# Altium schematic sheet F4 DFC.SchDoc: F4 Drone Flight Controller
size A4; Author: Miłosz Werner & Julia Rzepka; DrawnBy: Miłosz Werner; Organization: Wroclaw University of Science and Technology; DocumentNumber: 1; Revision: 1.0; SheetNumber: 1; SheetTotal: 9
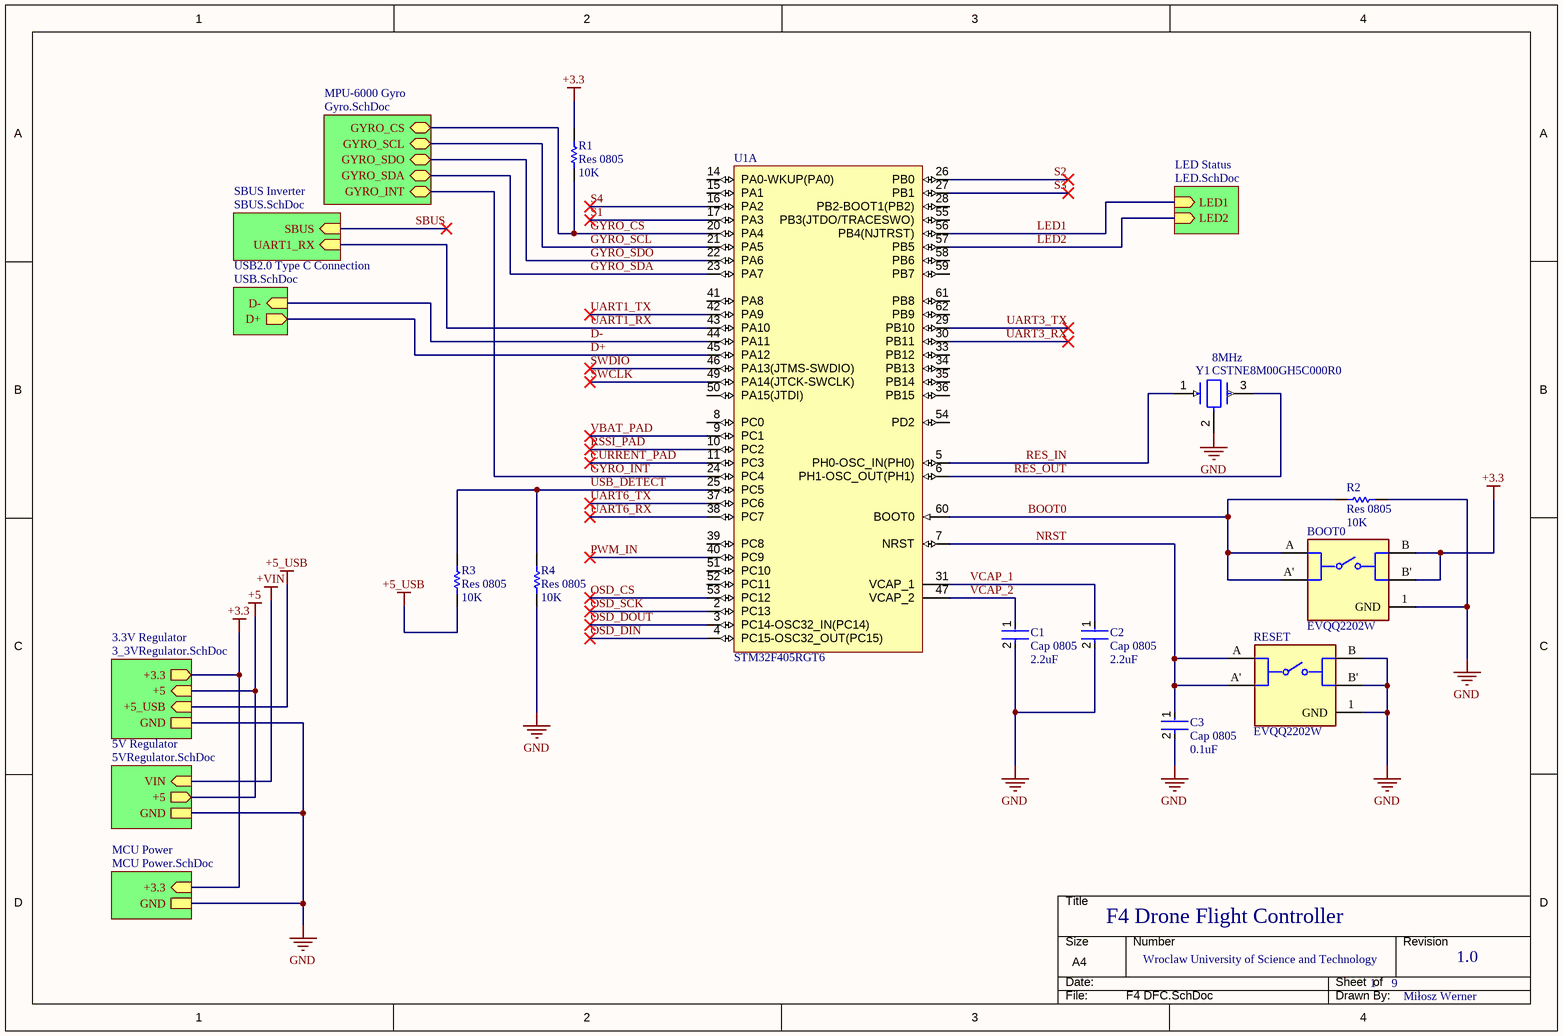
[diagram p0: F4 DFC.SchDoc]

## Parts
BOOT0  EVQQ2202W  [FP-EVQQ2202W-MFG]
C1  Cap 0805  value 2.2uF  [FP-GRM216-0_1-IPC_C]
C2  Cap 0805  value 2.2uF  [FP-GRM216-0_1-IPC_C]
C3  Cap 0805  value 0.1uF  [FP-GRM216-0_1-IPC_C]
R1  Res 0805  value 10K  [RESC2013X50X30LL20T20]
R2  Res 0805  value 10K  [RESC2013X50X30LL20T20]
R3  Res 0805  value 10K  [RESC2013X50X30LL20T20]
R4  Res 0805  value 10K  [RESC2013X50X30LL20T20]
RESET  EVQQ2202W  [FP-EVQQ2202W-MFG]
U1  STM32F405RGT6  [STM-LQFP64_V]  (part A of 2)
Y1  CSTNE8M00GH5C000R0  value 8MHz  [FP-CSTNE8M00GH5C000R0-MFG]

## Sub-sheets
3.3V Regulator = 3_3VRegulator.SchDoc: +3.3 (out), +5 (in), +5_USB (in), GND
5V Regulator = 5VRegulator.SchDoc: VIN (in), +5 (out), GND
LED Status = LED.SchDoc: LED1 (in), LED2 (in)
MCU Power = MCU Power.SchDoc: +3.3 (in), GND
MPU-6000 Gyro = Gyro.SchDoc: GYRO_SDO (bidir), GYRO_SCL (bidir), GYRO_CS (bidir), GYRO_SDA (bidir), GYRO_INT (bidir)
SBUS Inverter = SBUS.SchDoc: UART1_RX (in), SBUS (in)
USB2.0 Type C Connection = USB.SchDoc: D- (in), D+ (out)

## Nets
+3.3: BOOT0.B BOOT0.B' R1.2 ; sheet 3.3V Regulator/+3.3, sheet MCU Power/+3.3
+5: sheet 3.3V Regulator/+5, sheet 5V Regulator/+5
+5_USB: R3.1 ; sheet 3.3V Regulator/+5_USB
+VIN: sheet 5V Regulator/VIN
GND: BOOT0.1(GND) C1.2 C2.2 C3.2 R2.1 R4.1 RESET.1(GND) RESET.B RESET.B' Y1.2(GND) ; sheet 3.3V Regulator/GND, sheet MCU Power/GND, sheet 5V Regulator/GND
BOOT0: BOOT0.A BOOT0.A' R2.2 U1.60(BOOT0)
CURRENT_PAD: U1.11(PC3)
D+: U1.45(PA12) ; sheet USB2.0 Type C Connection/D+
D-: U1.44(PA11) ; sheet USB2.0 Type C Connection/D-
GYRO_CS: R1.1 U1.20(PA4) ; sheet MPU-6000 Gyro/GYRO_CS
GYRO_INT: U1.24(PC4) ; sheet MPU-6000 Gyro/GYRO_INT
GYRO_SCL: U1.21(PA5) ; sheet MPU-6000 Gyro/GYRO_SCL
GYRO_SDA: U1.23(PA7) ; sheet MPU-6000 Gyro/GYRO_SDA
GYRO_SDO: U1.22(PA6) ; sheet MPU-6000 Gyro/GYRO_SDO
LED1: U1.56(PB4(NJTRST)) ; sheet LED Status/LED1
LED2: U1.57(PB5) ; sheet LED Status/LED2
NRST: C3.1 RESET.A RESET.A' U1.7(NRST)
OSD_CS: U1.53(PC12)
OSD_DIN: U1.4(PC15-OSC32_OUT(PC15))
OSD_DOUT: U1.3(PC14-OSC32_IN(PC14))
OSD_SCK: U1.2(PC13)
PWM_IN: U1.40(PC9)
RES_IN: U1.5(PH0-OSC_IN(PH0)) Y1.1(Input)
RES_OUT: U1.6(PH1-OSC_OUT(PH1)) Y1.3(Output)
RSSI_PAD: U1.10(PC2)
S1: U1.17(PA3)
S2: U1.26(PB0)
S3: U1.27(PB1)
S4: U1.16(PA2)
SBUS: sheet SBUS Inverter/SBUS
SWCLK: U1.49(PA14(JTCK-SWCLK))
SWDIO: U1.46(PA13(JTMS-SWDIO))
UART1_RX: U1.43(PA10) ; sheet SBUS Inverter/UART1_RX
UART1_TX: U1.42(PA9)
UART3_RX: U1.30(PB11)
UART3_TX: U1.29(PB10)
UART6_RX: U1.38(PC7)
UART6_TX: U1.37(PC6)
USB_DETECT: R3.2 R4.2 U1.25(PC5)
VBAT_PAD: U1.9(PC1)
VCAP_1: C2.1 U1.31(VCAP_1)
VCAP_2: C1.1 U1.47(VCAP_2)

Not connected (* = marked no-connect by the designer): U1 8(PC0) 14(PA0-WKUP(PA0)) 15(PA1) 28(PB2-BOOT1(PB2)) 33(PB12) 34(PB13) 35(PB14) 36(PB15) 39(PC8) 41(PA8) 50(PA15(JTDI)) 51(PC10) 52(PC11) 54(PD2) 55(PB3(JTDO/TRACESWO)) 58(PB6) 59(PB7) 61(PB8) 62(PB9)

## Notes on the sheet
- DWG. NO.
- REV.
- SHT.
- REVISION
- DESCRIPTION
- DATE
- APPROVED
- THIS DOCUMENT AND THE DATA DISCLOSED HEREIN OR HEREWITH IS THE PROPERTY OF ALTIUM LIMITED AND MAY BE FREELY DISTRIBUTED IN WHOLE. NO RIGHTS ARE RESERVED OR EXPRESS OR IMPLIED WARANTEE GIVEN.
- ENG:
- DSN:
- APPROVALS
- PROJECT
- DOCUMENT REVISION:
- DESIGN ITEM:
- CHK:
- BOM:
- REFERENCE DOCUMENTS
- PROJECT REVISION:
- TITLE
- FAB DWG:
- PCB DWG:
- ASSY DWG:
- SCALE:
- SIZE
- C
- CAGE CODE
- FILE NAME
- DWG NO.
- SHEET
- OF
- REV

## Library data of the parts
BOOT0 RESET = CMP-05618-000131-1: SWITCH TACTILE SPST-NO 0.02A 15V; Mechanical Life: 100000Cycles; Actuator Length: 0.7mm; Operating Force: 3.5N; Contact Current Rating: 20mA; Actuator Type: Standard; Illumination Type: Non-Illuminated; Contact Resistance: 100mR; Switch Travel: 0.25mm; Actuator Color: White; Voltage Rating (AC): 250V; Body Depth: 6mm; Throw Configuration: SPST; Switch Function: Off-Mom; REACH SVHC: No SVHC; RoHS Compliant: Yes; Color: White; Radiation Hardening: No; Series: EVQQ2; Max Operating Temperature: 85°C; Thickness: 1.8mm; Lead Free: Lead Free; Electrical Life: 100000Cycles; Packaging: Tape and Reel; Max Voltage Rating (DC): 15V; Contact Plating: Silver; Length: 6mm; Mount: Surface Mount; Depth: 6.6mm; Current Rating: 20mA; Min Operating Temperature: -40°C; Voltage Rating (DC): 15V; Size: 1.8mm; Termination: SMD/SMT; Case/Package: SMD/SMT; Max Voltage Rating (AC): 250V; Orientation: Straight; Package Quantity: 1; Max Current Rating: 20mA
C1-C3 = CMP-2007-00889-2: Capacitor; Capacitance: 100nF; Mount: Surface Mount; Case/Package: 0805; Case Code (Imperial): 0805
R1-R4 = CMP-2001-03735-1: Resistor
U1 = CMP-0243-00019-3: ARM Cortex-M4 32-bit MCU+FPU, 210 DMIPS, 1024 kB Flash, 192 kB Internal RAM, 51 I/Os, 64-pin LQFP, -40 to 85 degC, Tray; Manufacturer: STMicroelectronics; Supply Voltage(Vcc) min (V): 1.8; Supply Voltage(Vcc) max (V): 3.6; Internal RAM Size (kB): 192; I/Os (High Current): 51; D/A Converter: 2x12-bit; FLASH Size (Prog) (kB): 1024; Operating Frequency(F) (Processor speed) (MHz): 168; ComponentLink2Description: Datasheet; PackageVersion: Rev. 4, 06/2013; DatasheetVersion: Rev. 4; Core: ARM Cortex-M4; ComponentLink2URL: http://www.st.com/st-web-ui/static/active/en/resource/technical/document/datasheet/DM00037051.pdf; PackageReference: LQFP64; Packing: Tray; ComponentLink1Description: Manufacturer URL; ComponentLink3URL: http://www.st.com/st-web-ui/static/active/en/resource/technical/document/datasheet/DM00037051.pdf; ComponentLink3Description: Package Specification; Mounting Technology: Surface Mount; ComponentLink1URL: http://www.st.com/web/en/home.html; PackageDescription: 64-Pin Low Profile Quad Flat Package, 10 x 10 mm Body, 0.5 mm Pitch; PartNumber: STM32F405RGT6
Y1 = CMP-06057-000001-1: CERAMIC RES 8.0000MHZ 33PF SMD; Frequency Stability: 0.13%; Frequency Tolerance: 0.07%; Impedance: 40R; Mount: Surface Mount; Min Operating Temperature: -40°C; Max Operating Temperature: 125°C; Resistor Type: Ceramic; Capacitance: 33pF; Packaging: Tape and Reel; Frequency: 8MHz; Case/Package: SMD/SMT